# EAGLE design EEprom_Logger_V1 (EAGLE 9.1.0)
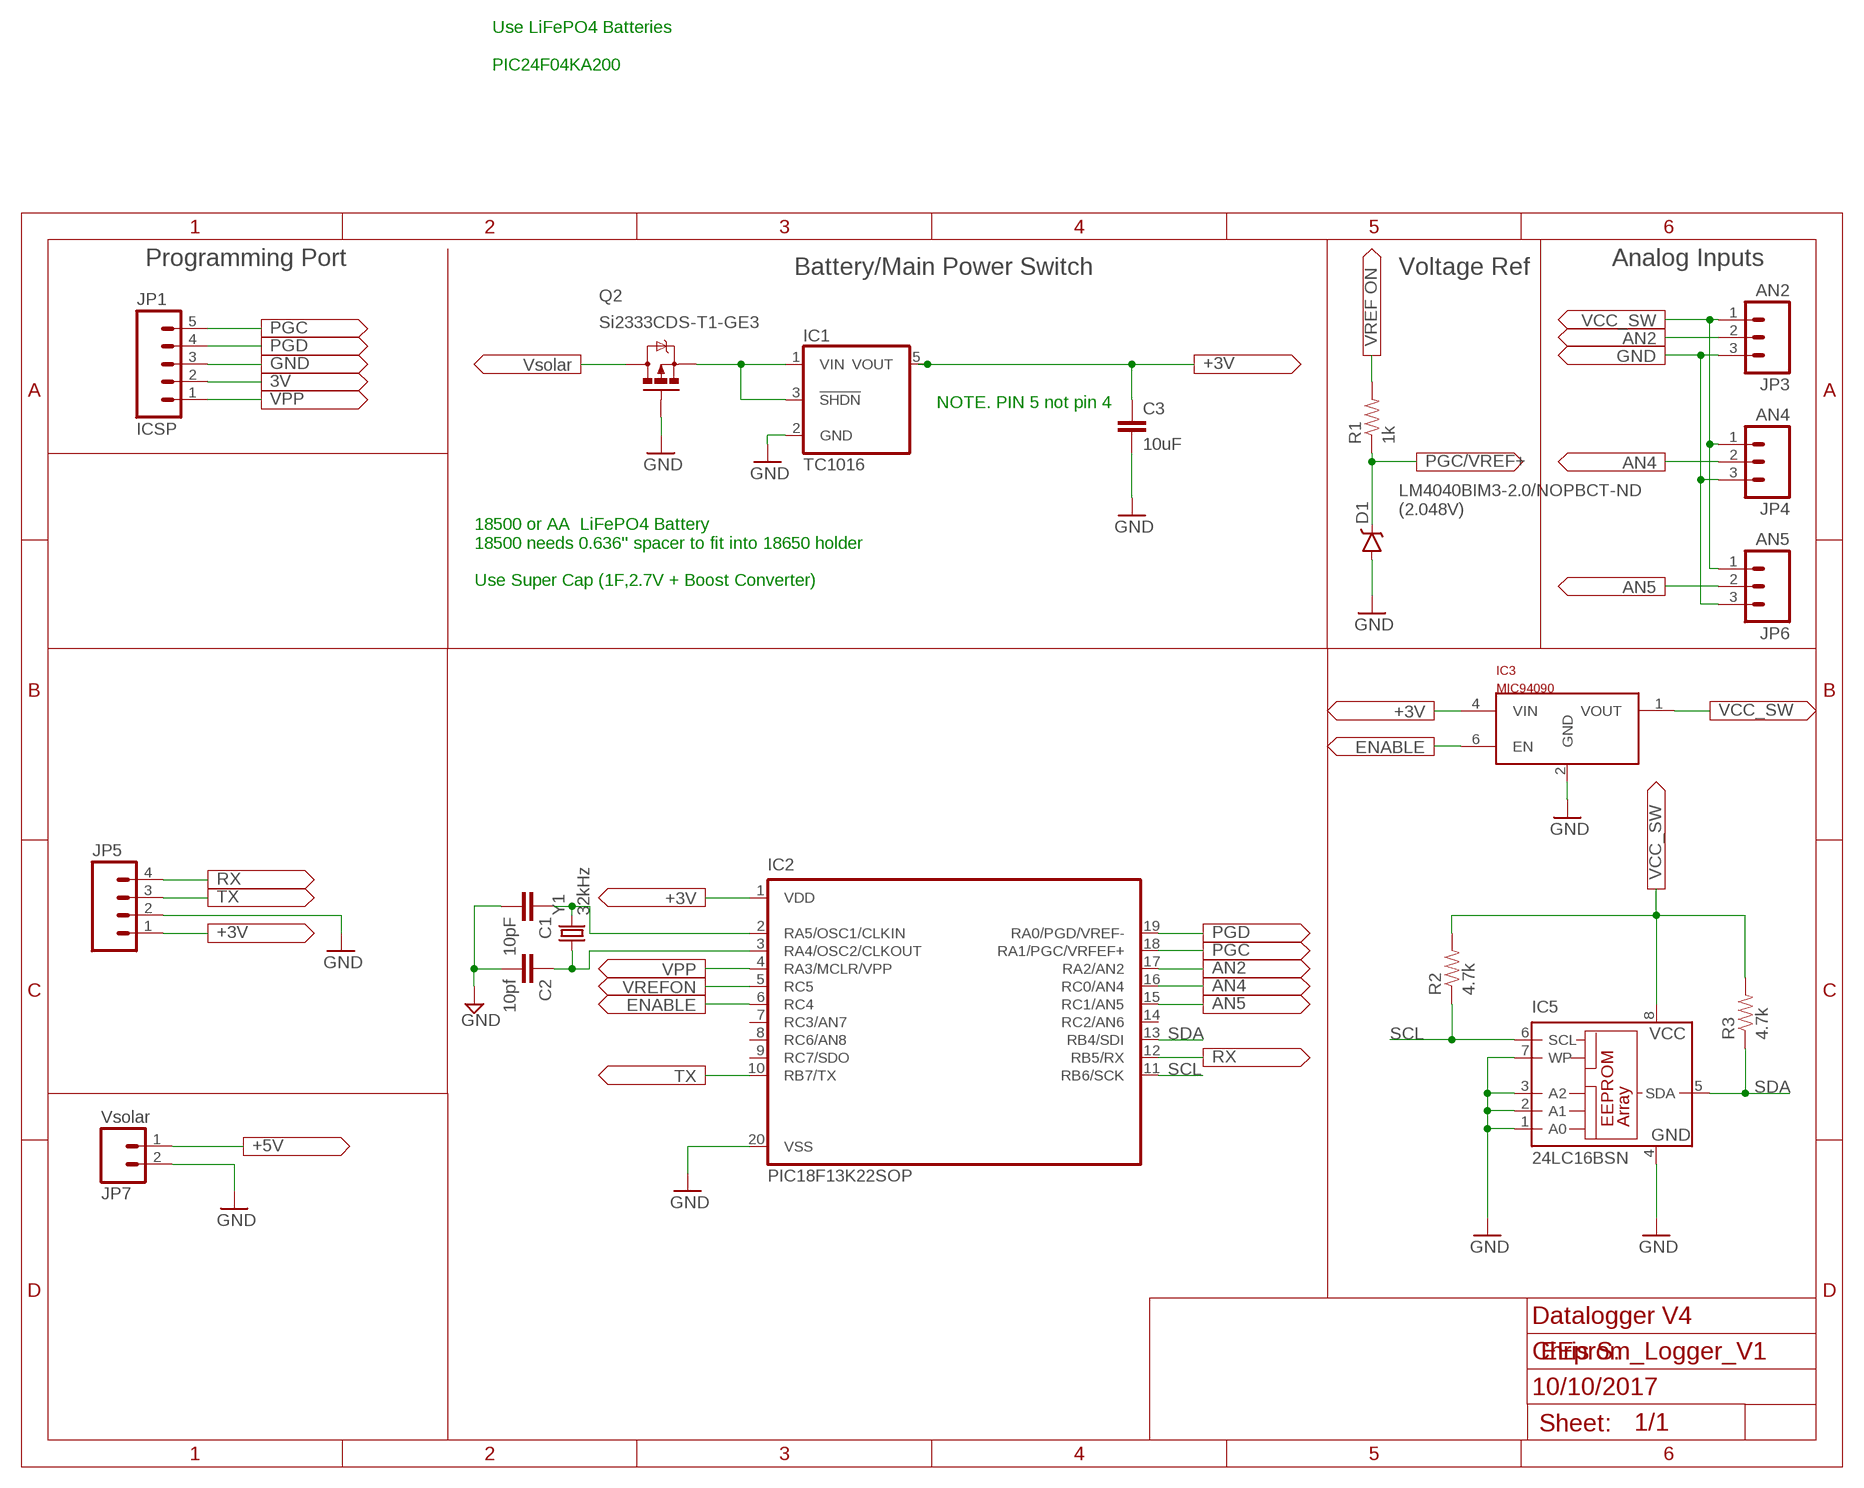
[diagram p0: schematic, sheet 1]

## Parts
C1  10pF  CAP1206  [1206]
C2  10pf  CAP1206  [1206]
C3  10uF  CAP1206  [1206]
D1  V-REFERENCESMD  [SOT23-3]
IC1  TC1016  [SOT23-5L]
IC2  PIC18F13K22SOP  [SOP20W]
IC3  MIC94090  [SC-70]
IC5  24LC16BSN  [SO-08]
JP1  ICSP  M05PTH  [1X05]
JP3  AN2  M03JST-PTH  [JST-3-PTH]
JP4  AN4  M03JST-PTH  [JST-3-PTH]
JP5  M04PTH  [1X04]
JP6  AN5  M03JST-PTH  [JST-3-PTH]
JP7  Vsolar  M02JST-PTH-2  [JST-2-PTH]
Q2  Si2333CDS-T1-GE3  MOSFET-PCHANNEL  [SOT23-3]
R1  1k  RESISTOR1206  [1206]
R2  4.7k  RESISTOR1206  [1206]
R3  4.7k  RESISTOR1206  [1206]
Y1  32kHz  CRYSTALTC26V  [TC26V]

## Nets
3V: C3.1 IC1.5(VOUT) IC2.1(VDD) IC3.4(VIN) JP1.2 JP5.1
AN2: IC2.17(RA2/AN2) JP3.2
AN4: IC2.16(RC0/AN4) JP4.2
AN5: IC2.15(RC1/AN5) JP6.2
ENABLE: IC2.6(RC4) IC3.6(EN)
GND: C1.2 C2.2 C3.2 D1.2(A) IC1.2(GND) IC2.20(VSS) IC3.2(GND) IC5.1(A0) IC5.2(A1) IC5.3(A2) IC5.4(GND) IC5.7(WP) JP1.3 JP3.3 JP4.3 JP5.2 JP6.3 JP7.2 Q2.1(G)
N$1: C1.1 IC2.2(RA5/OSC1/CLKIN) Y1.2
N$2: C2.1 IC2.3(RA4/OSC2/CLKOUT) Y1.1
PGC: D1.1(C) IC2.18(RA1/PGC/VRFEF+) JP1.5 R1.1
PGD: IC2.19(RA0/PGD/VREF-) JP1.4
RX: IC2.12(RB5/RX) JP5.4
SCL: IC2.11(RB6/SCK) IC5.6(SCL) R2.1
SDA: IC2.13(RB4/SDI) IC5.5(SDA) R3.1
SWITCHED_VCC: IC3.1(VOUT) IC5.8(VCC) JP3.1 JP4.1 JP6.1 R2.2 R3.2
TX: IC2.10(RB7/TX) JP5.3
VIN: IC1.1(VIN) IC1.3(!SHDN) Q2.2(S)
VPP: IC2.4(RA3/MCLR/VPP) JP1.1
VREFON: IC2.5(RC5) R1.2
VSOLAR: JP7.1 Q2.3(D)
Unconnected: IC2.7(RC3/AN7) IC2.8(RC6/AN8) IC2.9(RC7/SDO) IC2.14(RC2/AN6)

## Notes on the sheet
- Use LiFePO4 Batteries
  
  PIC24F04KA200
- Programming Port | Analog Inputs
- Battery/Main Power Switch
- Voltage Ref
- NOTE. PIN 5 not pin 4
- LM4040BIM3-2.0/NOPBCT-ND
  (2.048V)
- 18500 or AA  LiFePO4 Battery
  18500 needs 0.636'' spacer to fit into 18650 holder
  
  Use Super Cap (1F,2.7V + Boost Converter)
- Datalogger V4
- Chris S.
- 10/10/2017

## Library data of the parts
C1-C3 = SparkFun-Capacitors:CAP: Capacitor Standard 0603 ceramic capacitor, and 0.1" leaded capacitor.
D1 = SparkFun-DiscreteSemi:V-REFERENCE: Zener diode
IC1 = PIC18F13k22:TC1016
IC2 = PIC18F13k22:PIC18F13K22?: 18/20/28-Pin High-Performance, Enhanced Flash Microcontrollers with 10-bit A/D and nanoWatt Technology Source: ww1.microchip.com/downloads/en/DeviceDoc/39605c.pdf
IC3 = MIC94090:MIC94090: MIC94090 Load switch 130mOhm ON 1.2A Conti. Current
IC5 = microchip:24*: Serial EEPROM I2C; MF: MICROCHIP; MPN: 24LC16B/SN; OC_FARNELL: 9757945; OC_NEWARK: 12C2012
JP1 = SparkFun-Connectors:M05: Header 5 Standard 5-pin 0.1" header. Use with straight break away headers (SKU : PRT-00116), right angle break away headers (PRT-00553), swiss pins (PRT-00743), machine pins (PRT-00117), and female headers (PRT-00115). Molex polarized connector foot print use with SKU : PRT-08230 with associated crimp pins and housings.
JP3 JP4 JP6 = SparkFun-Connectors:M03: Header 3 Standard 3-pin 0.1" header. Use with straight break away headers (SKU : PRT-00116), right angle break away headers (PRT-00553), swiss pins (PRT-00743), machine pins (PRT-00117), and female headers (PRT-00115). Molex polarized connector foot print use with SKU : PRT-08232 with associated crimp pins and housings.; SKU: PRT-09915
JP5 = SparkFun-Connectors:M04: Header 4 Standard 4-pin 0.1" header. Use with straight break away headers (SKU : PRT-00116), right angle break away headers (PRT-00553), swiss pins (PRT-00743), machine pins (PRT-00117), and female headers (PRT-00115). Molex polarized connector foot print use with SKU : PRT-08231 with associated crimp pins and housings. 1MM SMD Version SKU: PRT-10208
JP7 = SparkFun-Connectors:M02: Standard 2-pin 0.1" header. Use with - straight break away headers ( PRT-00116) - right angle break away headers (PRT-00553) - swiss pins (PRT-00743) - machine pins (PRT-00117) - female headers (PRT-00115) Molex polarized connector foot print use with: PRT-08233 with associated crimp pins and housings. 2.54_SCREWTERM for use with PRT-10571. 3.5mm Screw Terminal footprints for PRT-08084 5mm Screw Terminal footprints for use with PRT-08432; SKU: PRT-09914
Q2 = SparkFun-DiscreteSemi:MOSFET-PCHANNEL: Generic PMOSFET IRLML2244 - TRANS-11153 (SOT-23 -20V -4.3A) (1.Gate 2.Source 3.Drain) FQP27P06 - COM-10349 <http://www.sparkfun.com/products/10349> (TO-220 -60V -27A) (1.Gate 2.Source 3.Drain); PROD_ID: TRANS-08285
R1-R3 = SparkFun-Resistors:RESISTOR: Resistor Basic schematic elements and footprints for 0603, 1206, and PTH resistors.
Y1 = crystal:CRYSTAL: CRYSTAL; OC_FARNELL: unknown; OC_NEWARK: unknown

## Board
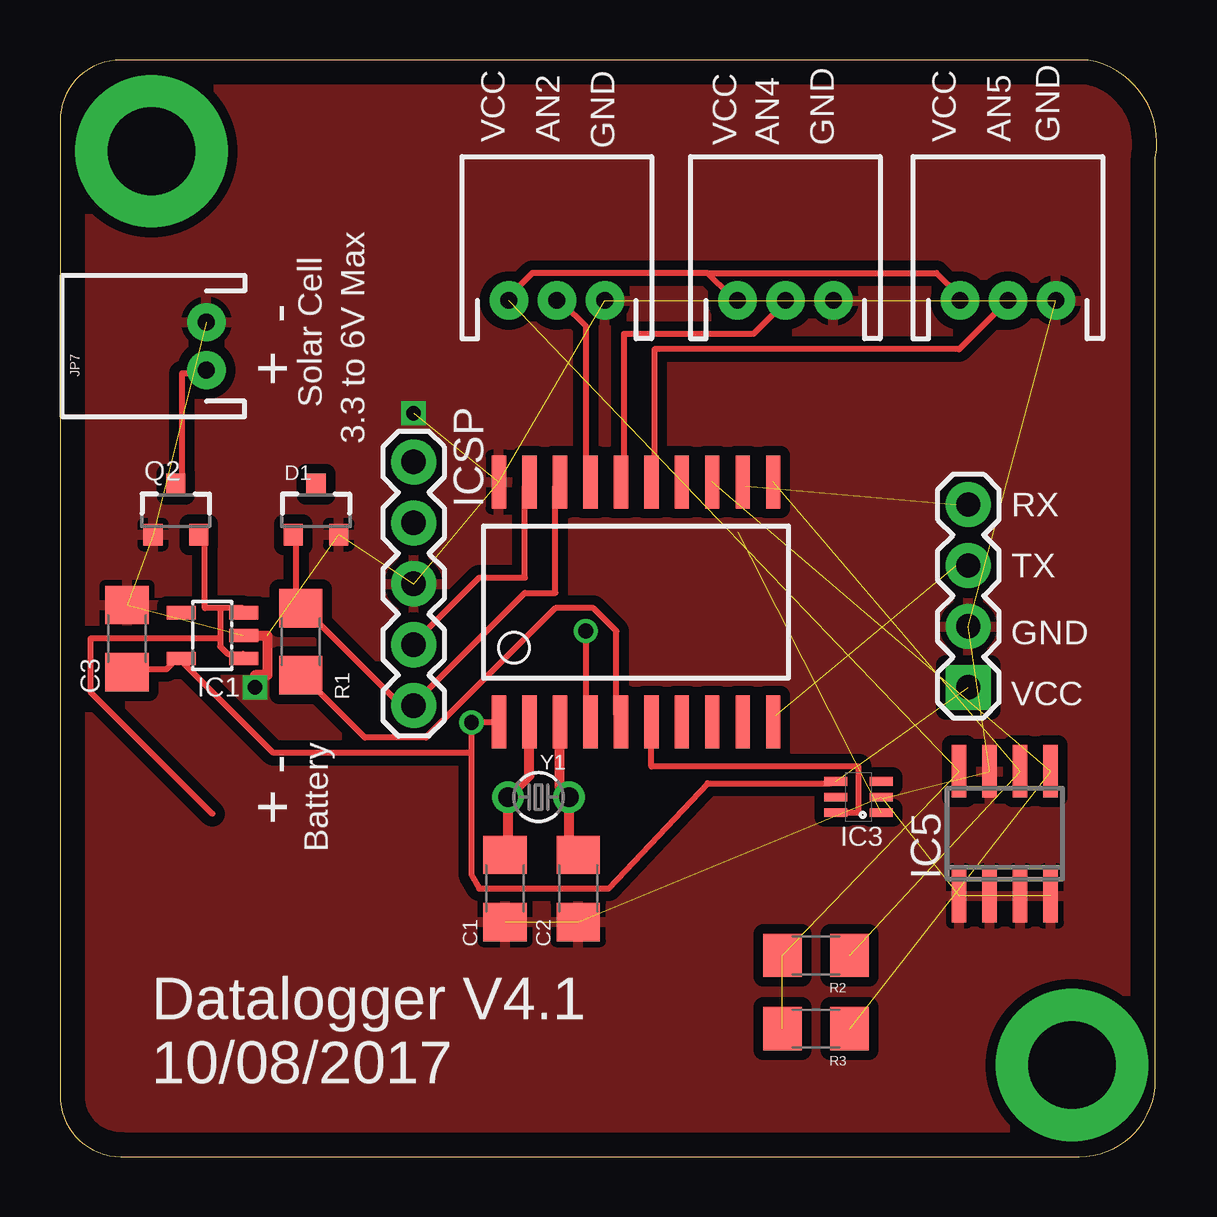
[diagram p1: board, top side]
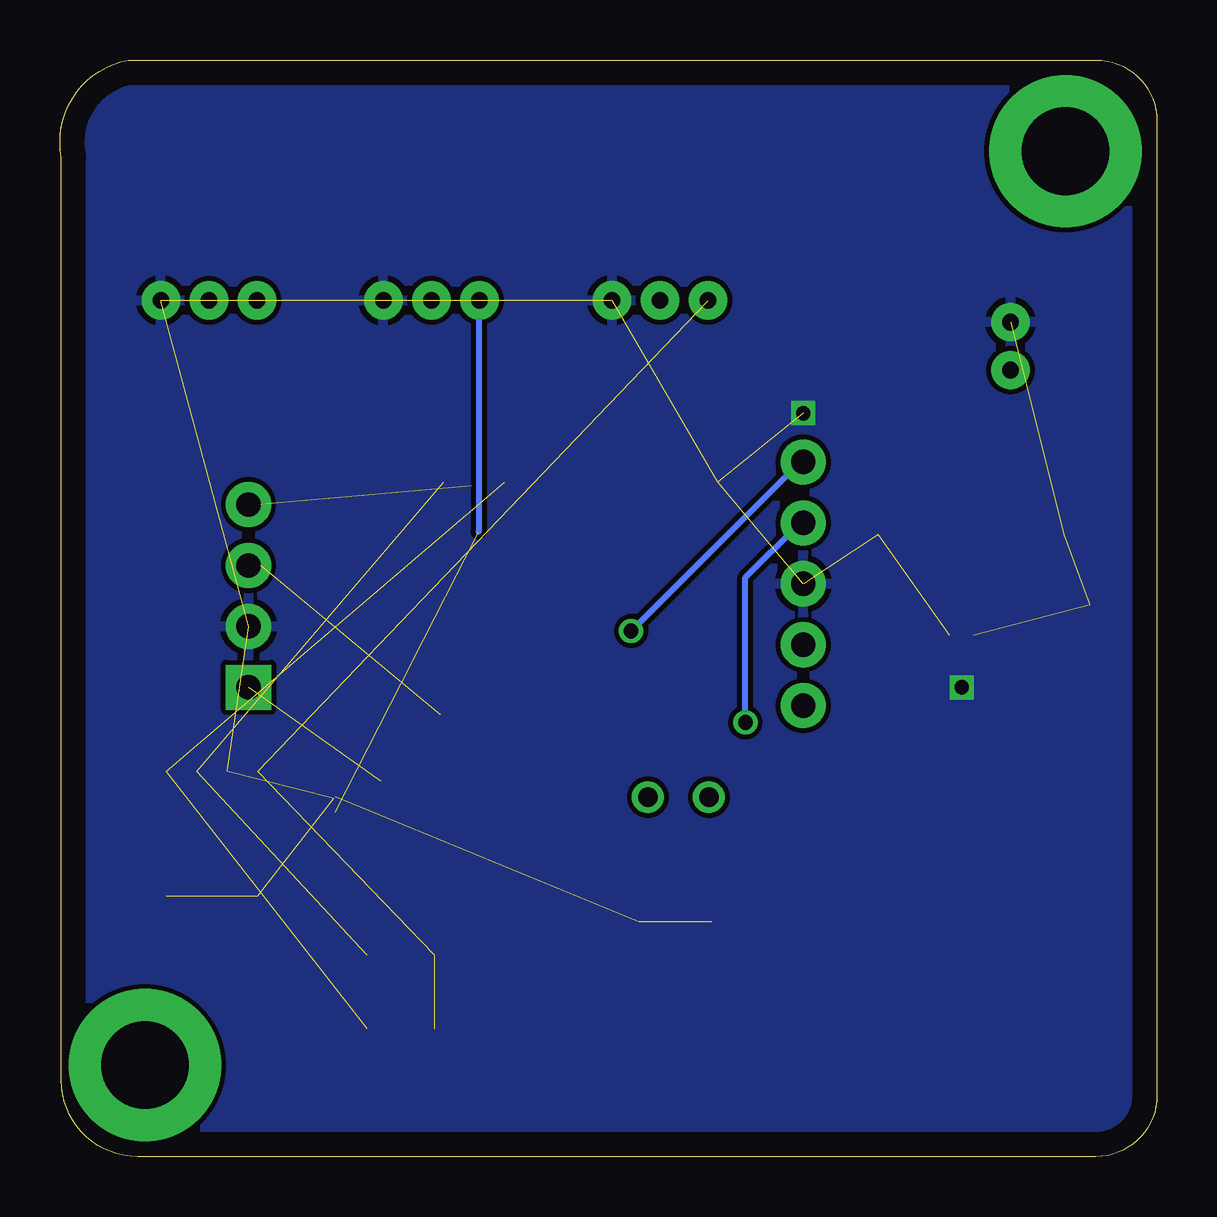
[diagram p2: board, bottom side, seen from below]

Size 45.7 x 45.71 mm. Coordinates in mm from the lower left corner, seen from the top.
Outline: 0,43.17 0,2.54 arc90 2.54,0 42.47,0 arc90 45.64,3.17 45.64,41.65 arc90 42.85,45.71 2.54,45.71 arc90 0,43.17
Copper layers (1*16): Top 0.035mm / dielectric 1.5mm / Bottom 0.035mm
Design rules "default": minimum track width 10mil, minimum drill 24mil, track to track 8mil, track to pad 8mil, pad to pad 8mil, via to via 8mil, smd to smd 8mil, copper to edge 40mil, drill to drill 8mil, minimum pad ring 10mil, minimum via ring 8mil, stop-mask expansion 4mil, vias tented up to drill 0mil, thermal gap 10mil

### Footprints (pad centres in the part's own frame; a part is rotated, then mirrored left to right if it is on the bottom)
1206 = smd 1.6 x 1.8: 1 -1.4,0; 2 1.4,0
SOT23-3 = smd 0.8 x 0.9: 1 -0.95,-1; 2 0.95,-1; 3 0,1.1
SOT23-5L = smd 0.55 x 1.2: 1 -0.95,-1.3; 2 0,-1.3; 3 0.95,-1.3; 4 0.95,1.3; 5 -0.95,1.3
SOP20W = smd 0.6 x 2.2: 1 -5.715,-5; 2 -4.445,-5; 3 -3.175,-5; 4 -1.905,-5; 5 -0.635,-5; 6 0.635,-5; 7 1.905,-5; 8 3.175,-5; 9 4.445,-5; 10 5.715,-5; 11 5.715,5; 12 4.445,5; 13 3.175,5; 14 1.905,5; 15 0.635,5; 16 -0.635,5; 17 -1.905,5; 18 -3.175,5; 19 -4.445,5; 20 -5.715,5
SC-70 = smd 0.36 x 0.95: 1 -0.65,-0.95; 2 0,-0.95; 3 0.65,-0.95; 4 0.65,0.95; 5 0,0.95; 6 -0.65,0.95
SO-08 = smd 0.6 x 2.2: 1 -1.905,-2.6; 2 -0.635,-2.6; 3 0.635,-2.6; 4 1.905,-2.6; 5 1.905,2.6; 6 0.635,2.6; 7 -0.635,2.6; 8 -1.905,2.6
1X05 = drill 1.016 pad 1.88: 1 0,0; 2 2.54,0; 3 5.08,0; 4 7.62,0; 5 10.16,0
JST-3-PTH = drill 0.7 pad 1.6: 1 -2,0; 2 0,0; 3 2,0
1X04 = drill 1.016 pad 1.88 square: 1 0,0 | drill 1.016 pad 1.88: 2 2.54,0; 3 5.08,0; 4 7.62,0
JST-2-PTH = drill 0.7 pad 1.6: 1 -1,0; 2 1,0
TC26V = drill 0.813: 1 -1.27,0; 2 1.27,0

### Placement (x,y rotation side)
C1  18.54,11.18 270 top
C2  21.59,11.18 270 top
C3  2.79,21.59 90 top
D1  10.67,26.92 0 top
IC1  6.35,21.72 90 top
IC2  24,23.11 0 top
IC3  33.27,14.99 90 top
IC5  39.37,13.46 0 top
JP1  14.73,28.96 270 top
JP3  20.7,35.69 0 top
JP4  30.23,35.69 0 top
JP5  37.85,19.56 90 top
JP6  39.5,35.69 0 top
JP7  6.1,33.78 90 top
Q2  4.83,26.92 0 top
R1  10.03,21.46 270 top
R2  31.5,8.38 180 top
R3  31.5,5.33 180 top
Y1  19.94,14.99 180 top

### Tracks (layer width: path | path; a pad name or v marks a point on that pad's centre or on a via)
3V  (via drill 0.61)  (1 unrouted)
  Top 0.254: C3.1 2.86,20.32 4.45,20.32 4.76,20.64 IC1.5 5.08,20.64 8.89,16.83 17.14,16.83 | 17.14,16.83 v17.14,18.1 18.1,18.1 IC2.1 | 17.14,16.83 17.14,11.75 17.46,11.18 22.86,11.18 26.99,15.56 32.07,15.56 IC3.4
  Bottom 0.254: v17.14,18.1 17.14,24.13 14.92,26.35 JP1.2
AN2
  Top 0.254: IC2.17 21.91,28.26 21.91,34.61 20.95,35.56 JP3.2
AN4
  Top 0.254: IC2.16 23.5,28.26 23.5,34.29 28.89,34.29 30.16,35.56 JP4.2
AN5
  Top 0.254: JP6.2 37.47,33.66 24.77,33.66 24.77,28.26 IC2.15
ENABLE
  Top 0.254: IC3.6 33.27,14.34 33.27,16.26 24.64,16.26 IC2.6
GND  (via drill 0.6)  (19 unrouted)
  Top 0.254: 34.29,14.92 IC3.2
  Top 0.406: IC1.2 8.64,21.72 8.64,20.07 8.13,20.07 v8.13,19.56
  other vias: 14.73,30.99
  pour Top (isolate 0.406): 0,45.72 67.31,45.72 67.31,0 0,0
  pour Bottom: 0.76,47.24 48.77,47.24 48.77,-1.27 -1.52,-1.27 -1.52,47.24
N$1
  Top 0.406: IC2.2 19.56,15.88 Y1.2 18.67,12.7 C1.1
N$2
  Top 0.406: IC2.3 20.83,15.37 Y1.1 21.21,12.96 C2.1
N$3  (via drill 3.66 pad 6.35)
  other vias: 42.16,3.81
N$8  (via drill 3.66 pad 6.35)
  other vias: 3.81,41.91
PGC
  Top 0.254: D1.1 9.84,25.72 9.84,23.18 R1.1 10.16,22.86 13.97,19.05 14.61,19.05 JP1.5 14.92,19.05 19.37,23.49 20.64,23.49 20.64,27.94 IC2.18
PGD
  Top 0.254: IC2.19 19.37,27.94 19.37,24.13 17.46,24.13 14.92,21.59 JP1.4
RX  (1 unrouted)
  Top 0.254: 28.57,27.94 IC2.12
  Bottom 0.406: JP5.4 37.34,27.18
SCL  (2 unrouted)
SDA  (2 unrouted)
SWITCHED_VCC  (4 unrouted)
  Top 0.254: 34.29,14.29 IC3.1 | 26.99,36.83 19.68,36.83 18.73,35.88 JP3.1 | 26.99,36.83 27.94,35.88 JP4.1 | 26.99,36.83 36.51,36.83 37.47,35.88 JP6.1
  Bottom 0.254: 28.26,26.04 28.26,35.56 JP4.1
TX  (1 unrouted)
  Top 0.254: 29.84,18.41 IC2.10
  Bottom 0.406: JP5.3 37.34,24.64
VIN
  Top 0.254: 6.67,22.86 7.62,22.86 IC1.3 | 6.67,22.86 6.03,22.86 6.03,25.72 Q2.2 | 6.67,22.86 6.67,21.59 | 6.67,21.59 6.67,21.27 6.99,20.95 7.62,20.95 IC1.1 | 6.35,14.29 1.27,19.37 1.27,21.59 6.67,21.59
VPP  (via drill 0.61)
  Top 0.254: v21.91,21.91 21.91,18.41 IC2.4
  Bottom 0.254: v21.91,21.91 14.92,28.89 JP1.1
VREFON
  Top 0.254: R1.2 10.16,20 12.7,17.46 15.24,17.46 20.64,22.86 22.23,22.86 23.18,21.91 23.18,18.41 IC2.5
VSOLAR
  Top 0.254: Q2.3 5.08,28.26 5.08,32.64 6.03,32.64 JP7.1

### Text on the board
tPlace: RX | TX | GND | VCC
tNames: VCC | AN2 | VCC | AN4 | GND | VCC | AN5 | GND | GND | - | + | Solar Cell | 3.3 to 6V Max | - | + | Battery | IC3 | Datalogger V4.1 / 10/08/2017